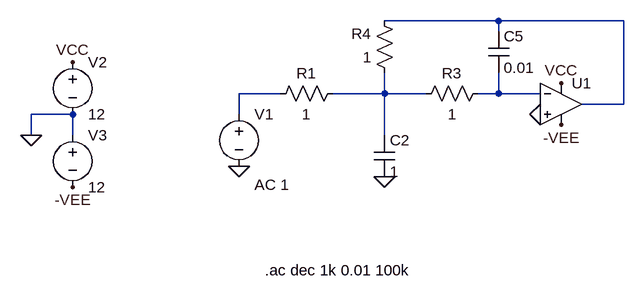
[diagram p0: schematic Draft1.asc]
Draft1.asc, the LTspice schematic file:
Version 4
SHEET 1 880 680
WIRE 336 64 160 64
WIRE 528 64 336 64
WIRE 336 80 336 64
WIRE 0 176 -64 176
WIRE 160 176 160 144
WIRE 160 176 80 176
WIRE 224 176 160 176
WIRE 336 176 336 144
WIRE 336 176 304 176
WIRE 400 176 336 176
WIRE 528 192 528 64
WIRE 528 192 464 192
WIRE -320 208 -384 208
WIRE -64 208 -64 176
WIRE -384 240 -384 208
WIRE -320 240 -320 208
WIRE 160 240 160 176
FLAG 160 304 0
FLAG 400 208 0
FLAG -64 288 0
FLAG -384 240 0
FLAG -320 128 VCC
FLAG -320 320 -VEE
FLAG 432 160 VCC
FLAG 432 224 -VEE
SYMBOL res 96 160 R90
WINDOW 0 0 56 VBottom 2
WINDOW 3 32 56 VTop 2
SYMATTR InstName R1
SYMATTR Value 1
SYMBOL res 176 160 R180
WINDOW 0 36 76 Left 2
WINDOW 3 36 40 Left 2
SYMATTR InstName R4
SYMATTR Value 1
SYMBOL res 208 192 R270
WINDOW 0 32 56 VTop 2
WINDOW 3 0 56 VBottom 2
SYMATTR InstName R3
SYMATTR Value 1
SYMBOL cap 144 240 R0
SYMATTR InstName C2
SYMATTR Value 1
SYMBOL cap 320 80 R0
SYMATTR InstName C5
SYMATTR Value 0.01
SYMBOL OpAmps\\UniversalOpamp2 432 192 R0
SYMATTR InstName U1
SYMBOL voltage -64 192 R0
WINDOW 123 24 124 Left 2
WINDOW 39 0 0 Left 0
SYMATTR InstName V1
SYMATTR Value ""
SYMATTR Value2 AC 1
SYMBOL voltage -320 112 R0
WINDOW 123 0 0 Left 0
WINDOW 39 0 0 Left 0
SYMATTR InstName V2
SYMATTR Value 12
SYMBOL voltage -320 224 R0
WINDOW 123 0 0 Left 0
WINDOW 39 0 0 Left 0
SYMATTR InstName V3
SYMATTR Value 12
TEXT -24 448 Left 2 !.ac dec 1k 0.01 100k

The netlist it stands for:
* Draft1.asc
R1 N003 N002 1
R4 N003 N001 1
R3 N003 N004 1
C2 N003 0 1
C5 N001 N004 0.01
XU1 0 N004 VCC -VEE N001 level.2 Avol=1Meg GBW=10Meg Slew=10Meg ilimit=25m rail=0 Vos=0 phimargin=45 en=0 enk=0 in=0 ink=0 Rin=500Meg  ; pins IN+ IN- V+ V- OUT
V1 N002 0 AC 1
V2 VCC 0 12
V3 0 -VEE 12
.ac dec 1k 0.01 100k
.lib UniversalOpamps2.sub
.backanno
.end